# Altium project vlc_ctrl.PrjPcb
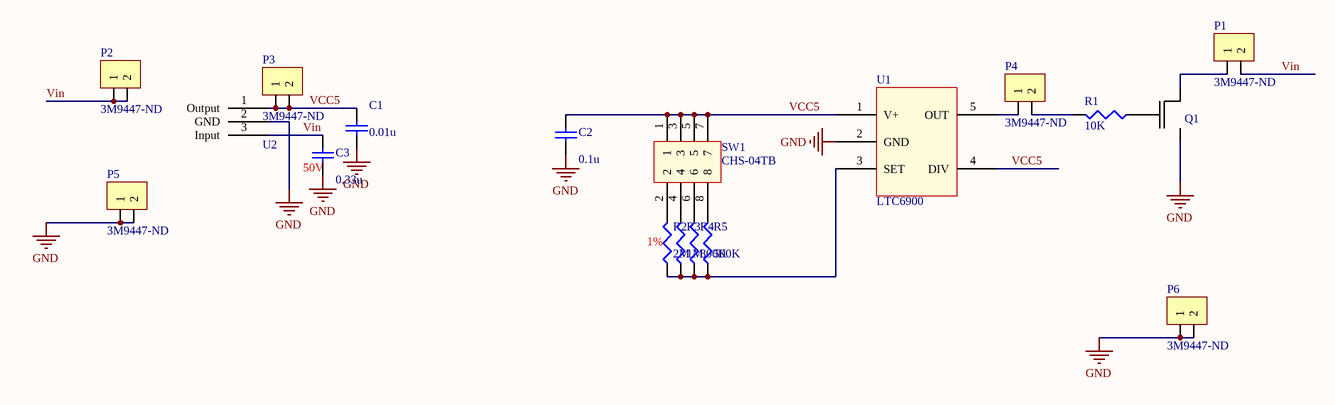
[diagram p0: vlc_ctrl.SchDoc]
1 sheet, 18 parts. Net scope: global (net labels, ports and power ports of the same name join across sheets).
Board file: vlc_ctrl.PcbDoc

## Sheet vlc_ctrl.SchDoc
size Letter

### Parts
C1  value 0.01u  [1608[0603]]  (hidden comment: Cap Semi)
C2  value 0.1u  [1608[0603]]  (hidden comment: Cap Semi)
C3  value 0.33u  [1608[0603]]  (hidden comment: Cap Semi)
P1  Supplier Part Number 1: 3M9447-ND  [1x2 header]  (hidden comment: 1 x 2 header)
P2  Supplier Part Number 1: 3M9447-ND  [1x2 header]  (hidden comment: 1 x 2 header)
P3  Supplier Part Number 1: 3M9447-ND  [1x2 header]  (hidden comment: 1 x 2 header)
P4  Supplier Part Number 1: 3M9447-ND  [1x2 header]  (hidden comment: 1 x 2 header)
P5  Supplier Part Number 1: 3M9447-ND  [1x2 header]  (hidden comment: 1 x 2 header)
P6  Supplier Part Number 1: 3M9447-ND  [1x2 header]  (hidden comment: 1 x 2 header)
Q1  Si2312CDS  [SOT95P250-3N]  (value not drawn)
R1  value 10K  [J1-0603]  (hidden comment: Res3)
R2  value 2M  [J1-0603]  (hidden comment: Res3)
R3  value 1M  [J1-0603]  (hidden comment: Res3)
R4  value 800K  [J1-0603]  (hidden comment: Res3)
R5  value 500K  [J1-0603]  (hidden comment: Res3)
SW1  CHS-04TB  [CHS04TB]
U1  LTC6900  [TSOT23]
U2  LM78L05  [TO92]  (value not drawn)

### Nets
GND: C1.1 C2.1 C3.1 P5.1 P5.2 P6.1 P6.2 Q1.2(S) U1.2(GND) U2.2(GND)
VCC5: C1.2 C2.2 P3.1 P3.2 SW1.1 SW1.3 SW1.5 SW1.7 U1.1(V+) U1.4(DIV) U2.1(Output)
Vin: C3.2 P1.2 P2.1 P2.2 U2.3(Input)
NetP1_1: P1.1 Q1.3(D)
NetP4_1: P4.1 U1.5(OUT)
NetP4_2: P4.2 R1.2
NetQ1_1: Q1.1(G) R1.1
NetR2_1: R2.1 R3.1 R4.1 R5.1 U1.3(SET)
NetR2_2: R2.2 SW1.2
NetR3_2: R3.2 SW1.4
NetR4_2: R4.2 SW1.6
NetR5_2: R5.2 SW1.8

### Notes on the sheet
- (near C3) 50V
- (near R2) 1%
- Title
- Date:
- Author:
- Revision:
- Sheet
- of
- University of Michigan
- File:

### Library data of the parts
C1-C3 = Cap Semi: Capacitor (Semiconductor SIM Model); Published: 8-Jun-2000; LatestRevisionDate: 29-May-2009; LatestRevisionNote: IPC-7351 Footprint Added.; PackageReference: C1206; Publisher: Altium Limited; PackageDescription: Chip Capacitor
P1-P6 = 1 x 2 header: 100 mils standard header; Supplier 1: Digi-Key
Q1 = Si2312CDS: N-Channel 20 V (D-S) MOSFET; Supplier 1: Digi-Key; Supplier Part Number 1: SI2312CDS-T1-GE3DKR-ND
R1-R5 = Res3: Resistor; Published: 8-Jun-2000; LatestRevisionDate: 29-May-2009; LatestRevisionNote: IPC-7351 Footprint Added.; PackageReference: J1-0603; Publisher: Altium Limited; PackageDescription: Chip Resistor
SW1 = CHS-04TB: SLIDE SWITCHES
U1 = LTC6900: Low Power, 1kHz to 20MHz   Resistor Set SOT-23 Oscillator; Supplier 1: Digi-Key; Supplier Part Number 1: LTC6900CS5#TRMCT-ND
U2 = LM78L05: LM78LXX Series 3-Terminal Positive Regulators; Supplier 1: Digi-Key; Supplier Part Number 1: LM78L05ACZNS/NOPB-ND